# Altium schematic sheet bumper.SchDoc
size A4; SheetNumber: 3; SheetTotal: 8
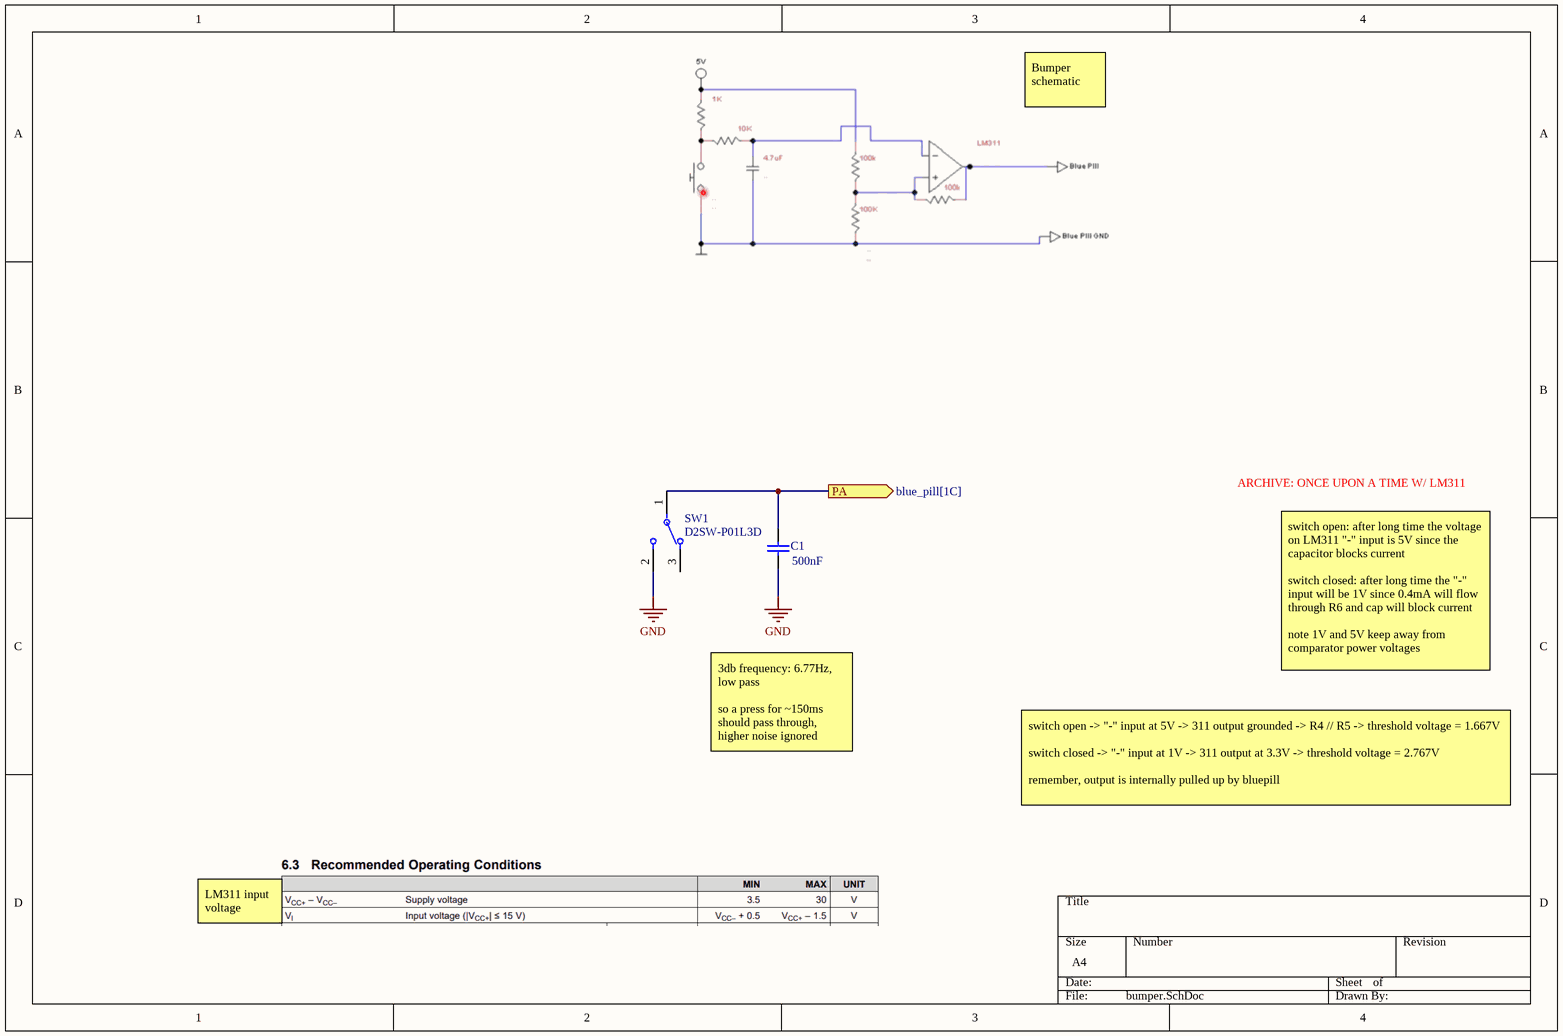
[diagram p0: bumper.SchDoc]

## Parts
C1  value 500nF  (hidden comment: Capacitor)
SW1  D2SW-P01L3D  [FP-D2SW-P01L3D-MFG]

## Ports
PA (out, see blue_pill[1C])

## Nets
GND: C1.2 SW1.2(NO)
PA: C1.1 SW1.1(COM) ; port PA

Not connected (* = marked no-connect by the designer): SW1 3(NC)

## Notes on the sheet
- Bumper schematic
- ARCHIVE: ONCE UPON A TIME W/ LM311
- switch open: after long time the voltage on LM311 "-" input is 5V since the capacitor blocks current
  switch closed: after long time the "-" input will be 1V since 0.4mA will flow through R6 and cap will block current
  note 1V and 5V keep away from comparator power voltages
- 3db frequency: 6.77Hz, low pass
  so a press for ~150ms should pass through, higher noise ignored
- switch open -> "-" input at 5V -> 311 output grounded -> R4 // R5 -> threshold voltage = 1.667V
  switch closed -> "-" input at 1V -> 311 output at 3.3V -> threshold voltage = 2.767V
  remember, output is internally pulled up by bluepill
- LM311 input voltage

## Library data of the parts
C1 = Capacitor: SimulationGenericComponent: True
SW1 = CMP-08833-000089-1: SWITCH SNAP ACT SPDT 100MA 125V; Number of Poles: 1; Operating Force: 0.6N; Switch Function: On-Mom; Approvals: UL; Electrical Life: 200000Cycles; Ratings: IP67; Max Voltage Rating (DC): 30V; Overtravel: 0.03inch; Operating Position: 0.42inch; Differential Travel: 0.031inch; Mechanical Life: 1000000Cycles; Actuator Type: SIMULATED ROLLER LEVER; Mount: Through Hole; Max Operating Temperature: 70°C; Voltage Rating (AC): 125V; Series: D2SW-P; Termination: PC Pin; Package Quantity: 500; RoHS Compliant: Yes; Min Operating Temperature: -20°C; Voltage Rating (DC): 30V; Contact Current Rating: 100mA; Current Rating: 100mA; Orientation: Straight; Packaging: Bulk; Lead Free: Lead Free; Contact Material: Gold; Throw Configuration: SPDT; Max Voltage Rating (AC): 125V